# Altium project Blackbox_V2.PrjPcb
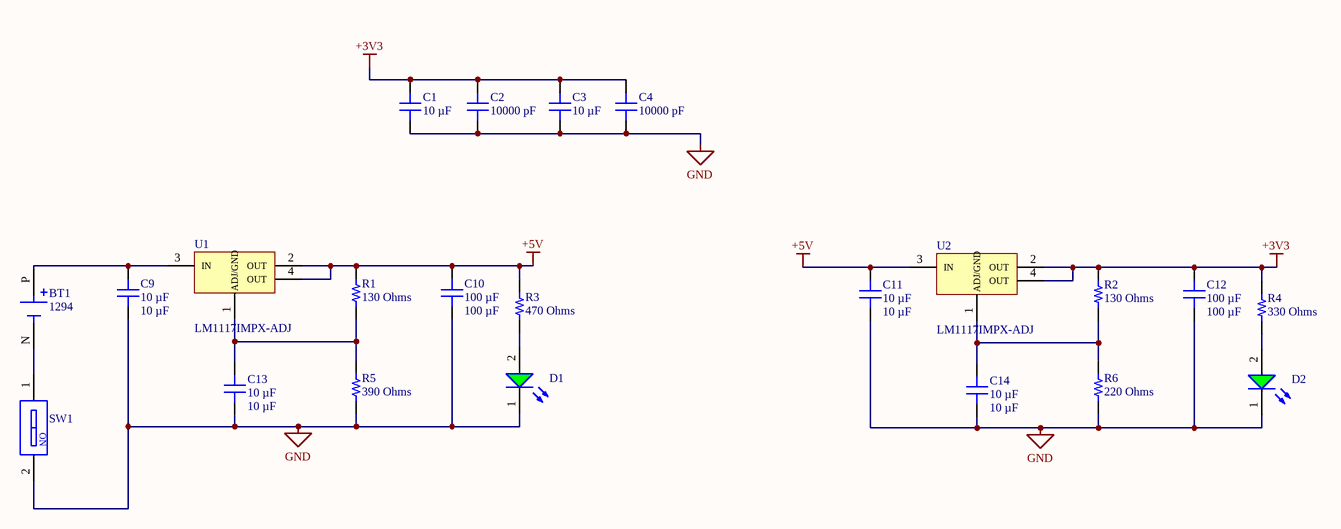
[diagram p0: Power.SchDoc]
4 sheets, 76 parts. Net scope: flat (ports and power ports of the same name join across sheets).
Board files: PCB1.PcbDoc, PCB2.PcbDoc
Sheets:
  Power.SchDoc
  Communication.SchDoc
  Microcontroller.SchDoc
  Filters.SchDoc

## Sheet Power.SchDoc
size A4; SheetNumber: 1; SheetTotal: 4; SPICEModelCacheJPOIHVMT: <root> / <DocumentId>JPOIHVMT</DocumentId> / <CacheFrame Number="0"> / <Model Name="0805_150080gs75000" Kind="CKT"> / <Text>****** / .subckt 0805_150080GS75000  1  2 / D1 1 2 SMCW / .MODEL SMCW D / + IS=906.98E-12 / + N=4.4982 / + RS=1.5743 / + IKF=518.93E-9 / + CJO=1.0000E-12 / + M=.3333 / + VJ=.75 / + BV=5 / + IBV=10.00E-6 / + TT=5.0000E-9 / .ends</Text> / </Model> / </CacheFrame> / </root>

### Parts
BT1  1294  [BAT_1294]
C1  10 µF  [CAP 0805_2012]
C2  10000 pF  [CAP 0805_2012]
C3  10 µF  [CAP 0805_2012]
C4  10000 pF  [CAP 0805_2012]
C9  10 µF  [CAP 0805_2012]
C10  100 µF  [CAP 0805_2012]
C11  10 µF  [CAP 0805_2012]
C12  100 µF  [CAP 0805_2012]
C13  10 µF  [CAP 0805_2012]
C14  10 µF  [CAP 0805_2012]
D1  Green, 3.2V, 140°  [WL-SMCW_0805_150080xx75000]  (value not drawn)
D2  Green, 3.2V, 140°  [WL-SMCW_0805_150080xx75000]  (value not drawn)
R1  130 Ohms  [RES 0805_2012]
R2  130 Ohms  [RES 0805_2012]
R3  470 Ohms  [RES 0805_2012]
R4  330 Ohms  [RES 0805_2012]
R5  390 Ohms  [RES 0805_2012]
R6  220 Ohms  [RES 0805_2012]
SW1  418121270801  [418121270801]  (value not drawn)
U1  LM1117IMPX-ADJ  [SOT-223-4 M]
U2  LM1117IMPX-ADJ  [SOT-223-4 M]

### Nets
+3V3: C1.1 C2.2 C3.1 C4.2 C12.2 R2.2 R4.2 U2.2(OUT) U2.4(OUT)
+5V: C10.2 C11.2 R1.2 R3.2 U1.2(OUT) U1.4(OUT) U2.3(IN)
GND: C1.2 C2.1 C3.2 C4.1 C9.1 C10.1 C11.1 C12.1 C13.1 C14.1 D1.1(K) D2.1(K) R5.1 R6.1 SW1.2
NetBT1_N: BT1.N(NEG) SW1.1
NetBT1_P: BT1.P(POS) C9.2 U1.3(IN)
NetC13_2: C13.2 R1.1 R5.2 U1.1(ADJ/GND)
NetC14_2: C14.2 R2.1 R6.2 U2.1(ADJ/GND)
NetD1_2: D1.2(A) R3.1
NetD2_2: D2.2(A) R4.1

### Notes on the sheet
- (in symbol 418121270801) ON

### Library data of the parts
BT1 = Bat-1294: 9V battery holder; Package: None; MP: 1294; Value: *; Availability: Unavailable; Price: None
C1 C3 = C0805C106K3PAC7800: CAP CER 10UF 25V X5R 0805; manufacturer: KEMET; Tolerance: ±10%; Part Number: C0805C106K3PAC7800; Value: 10 µF; Applications: Bypass, Decoupling; Capacitance: 10 µF; componentlink1description: Datasheet; componentlink1url: https://api.kemet.com/component-edge/download/datasheet/C0805C106K3PAC7800.pdf; componentlink2description: DigiKey Link; componentlink2url: https://www.digikey.com/en/products/detail/kemet/C0805C106K3PAC7800/5267604; Device Package: 0805 (2012 Metric); lastupdated: 9.02.2024 20:15:18; Lifecycle Status: Active; Minimum Order: 1; Mounting Type: Surface Mount, MLCC; Operating Temperature: -55°C ~ 85°C; Package / Case: 0805 (2012 Metric); packaging: TapeAndReel; partid: 18542; Part Status: Active; price: 0.03; series: SMD Comm X5R; Size / Dimension: 0.079" L x 0.049" W (2.00mm x 1.25mm); Supplier 1: DigiKey; Supplier Part Number 1: 399-11939-1-ND; Temperature Coefficient: X5R; Thickness (Max): 0.057" (1.45mm); Voltage - Rated: 25V
C2 C4 = C0805C103J3GECAUTO: CAP CER 0805 10NF 25V C0G 5%; manufacturer: KEMET; Temperature Coefficient: C0G, NP0; Part Number: C0805C103J3GECAUTO; Value: 10000 pF; Applications: Automotive, ESD Protection; Capacitance: 10000 pF; componentlink1description: Datasheet; componentlink1url: https://api.kemet.com/component-edge/download/datasheet/C0805C103J3GECAUTO.pdf; componentlink2description: DigiKey Link; componentlink2url: https://www.digikey.com/en/products/detail/kemet/C0805C103J3GECAUTO/8647361; Device Package: 0805 (2012 Metric); Features: Low ESL; lastupdated: 9.02.2024 20:15:09; Lifecycle Status: Active; Minimum Order: 1; Mounting Type: Surface Mount, MLCC; Operating Temperature: -55°C ~ 125°C; Package / Case: 0805 (2012 Metric); packaging: TapeAndReel; partid: 32681; Part Status: Active; price: 0.05; Ratings: AEC-Q200; series: ESD SMD Auto C0G; Size / Dimension: 0.079" L x 0.049" W (2.00mm x 1.25mm); Supplier 1: DigiKey; Supplier Part Number 1: 399-C0805C103J3GECAUTOCT-ND; Thickness (Max): 0.039" (1.00mm); Tolerance: ±5%; Voltage - Rated: 25V
C9 C11 C13 C14 = CL21Y106KPQVPNE: CAP CER 10UF 10V X7S 0805; Part Number: CL21Y106KPQVPNE; Value: 10 µF
C10 C12 = PMK212BBJ107MG-T: CAP CER 100UF 2.5V X5R 0805; Part Number: PMK212BBJ107MG-T; Value: 100 µF
D1 D2 = 150080GS75000: WL-SMCW Mono-color Chip LED Waterclear, size 0805, Green, 3.2V, 140°; Manufacturer: Wurth Elektronik; Case/Size Code: 0805; Chip Technology: InGaN; Dominant Wavelength: 525nm; Luminous Intensity: 450mcd; Peak Wavelength: 515nm; Manufacturer Part Number: 150080GS75000; Category: Signal LEDs; Match Code: WL-SMCW; ComponentLink1Description: Website Link; ComponentLink1URL: https://www.we-online.com/redexpert/article/150080GS75000?ad; ComponentLink2Description: Datasheet Link; ComponentLink2URL: https://www.we-online.com/redexpert/spec/150080GS75000?ad; Mount: Surface Mount; Operating Temperature Max: 85°C; Operating Temperature Min: -40°C; Packaging: Tape and Reel; Length: 2mm; Width: 1.25mm; Height: 0.7mm; Emitting Color: Green; Forward Voltage: 3.2V; Viewing Angle: 140°
R1 R2 = 3-2176091-5: RES SMD 130 OHM 0.1% 1/4W 0805; Manufacturer: TE Connectivity Passive Product; Power (Watts): 0.25W, 1/4W; Temperature Coefficient: ±25ppm/°C; Part Number: 3-2176091-5; Value: 130 Ohms; ComponentLink1Description: Datasheet; ComponentLink1URL: https://www.te.com/commerce/DocumentDelivery/DDEController?Action=srchrtrv&DocNm=1773272&DocType=DS&DocLang=English; ComponentLink2Description: DigiKey Link; ComponentLink2URL: https://www.digikey.com/en/products/detail/te-connectivity-passive-product/3-2176091-5/4033926; Composition: Thin Film; Device Package: 0805 (2012 Metric); Height - Seated (Max): 0.026" (0.65mm); LastUpdated: 8.02.2024 21:00:46; Lifecycle Status: Active; Minimum Order: 1; Number of Terminations: 2; Operating Temperature: -55°C ~ 155°C; Package / Case: 0805 (2012 Metric); Packaging: TapeAndReel; PartId: 49761; Part Status: Active; Price: 0.14; Resistance: 130 Ohms; Series: RP73P, Holsworthy; Size / Dimension: 0.079" L x 0.049" W (2.00mm x 1.25mm); Supplier 1: DigiKey; Supplier Part Number 1: A110458CT-ND; Supplier Device Package: 0805; Tolerance: ±0.1%
R3 = 3430A2F470RTDF: 3430 A2 1% 470R 100PPM 1K RL; Manufacturer: TE Connectivity Passive Product; Power (Watts): 1W; Temperature Coefficient: ±100ppm/°C; Part Number: 3430A2F470RTDF; Value: 470 Ohms; ComponentLink2Description: DigiKey Link; ComponentLink2URL: https://www.digikey.com/en/products/detail/te-connectivity-passive-product/3430A2F470RTDF/17763718; Composition: Thick Film; Device Package: 0805 (2012 Metric); Features: Automotive AEC-Q200; Height - Seated (Max): 0.026" (0.65mm); LastUpdated: 8.02.2024 21:00:03; Lifecycle Status: Active; Minimum Order: 1; Number of Terminations: 2; Operating Temperature: -55°C ~ 155°C; Package / Case: 0805 (2012 Metric); Packaging: TapeAndReel; PartId: 77780; Part Status: Active; Price: 0.02; Ratings: AEC-Q200; Resistance: 470 Ohms; Series: 3430; Size / Dimension: 0.049" L x 0.079" W (1.25mm x 2.00mm); Supplier 1: DigiKey; Supplier Part Number 1: 1712-3430A2F470RTDFCT-ND; Supplier Device Package: 0508; Tolerance: ±1%
R4 = 3430A2F330RTDF: 3430 A2 1% 330R 100PPM 1K RL; Manufacturer: TE Connectivity Passive Product; Power (Watts): 1W; Temperature Coefficient: ±100ppm/°C; Part Number: 3430A2F330RTDF; Value: 330 Ohms; ComponentLink2Description: DigiKey Link; ComponentLink2URL: https://www.digikey.com/en/products/detail/te-connectivity-passive-product/3430A2F330RTDF/17762827; Composition: Thick Film; Device Package: 0805 (2012 Metric); Features: Automotive AEC-Q200; Height - Seated (Max): 0.026" (0.65mm); LastUpdated: 8.02.2024 21:00:04; Lifecycle Status: Active; Minimum Order: 1; Number of Terminations: 2; Operating Temperature: -55°C ~ 155°C; Package / Case: 0805 (2012 Metric); Packaging: TapeAndReel; PartId: 77524; Part Status: Active; Price: 0.02; Ratings: AEC-Q200; Resistance: 330 Ohms; Series: 3430; Size / Dimension: 0.049" L x 0.079" W (1.25mm x 2.00mm); Supplier 1: DigiKey; Supplier Part Number 1: 1712-3430A2F330RTDFCT-ND; Supplier Device Package: 0508; Tolerance: ±1%
R5 = 3430A2F390RTDF: 3430 A2 1% 390R 100PPM 1K RL; Manufacturer: TE Connectivity Passive Product; Power (Watts): 1W; Temperature Coefficient: ±100ppm/°C; Part Number: 3430A2F390RTDF; Value: 390 Ohms; ComponentLink2Description: DigiKey Link; ComponentLink2URL: https://www.digikey.com/en/products/detail/te-connectivity-passive-product/3430A2F390RTDF/17763108; Composition: Thick Film; Device Package: 0805 (2012 Metric); Features: Automotive AEC-Q200; Height - Seated (Max): 0.026" (0.65mm); LastUpdated: 8.02.2024 21:00:03; Lifecycle Status: Active; Minimum Order: 1; Number of Terminations: 2; Operating Temperature: -55°C ~ 155°C; Package / Case: 0805 (2012 Metric); Packaging: TapeAndReel; PartId: 77771; Part Status: Active; Price: 0.02; Ratings: AEC-Q200; Resistance: 390 Ohms; Series: 3430; Size / Dimension: 0.049" L x 0.079" W (1.25mm x 2.00mm); Supplier 1: DigiKey; Supplier Part Number 1: 1712-3430A2F390RTDFCT-ND; Supplier Device Package: 0508; Tolerance: ±1%
R6 = CPF0805B220RE1: RES SMD 220 OHM 0.1% 1/10W 0805; Manufacturer: TE Connectivity Passive Product; Power (Watts): 0.1W, 1/10W; Temperature Coefficient: ±25ppm/°C; Part Number: CPF0805B220RE1; Value: 220 Ohms; ComponentLink1Description: Datasheet; ComponentLink1URL: https://www.te.com/commerce/DocumentDelivery/DDEController?Action=srchrtrv&DocNm=1773200&DocType=DS&DocLang=English; ComponentLink2Description: DigiKey Link; ComponentLink2URL: https://www.digikey.com/en/products/detail/te-connectivity-passive-product/CPF0805B220RE1/2382016; Composition: Thin Film; Device Package: 0805 (2012 Metric); Height - Seated (Max): 0.026" (0.65mm); LastUpdated: 8.02.2024 21:02:21; Lifecycle Status: Active; Minimum Order: 1; Number of Terminations: 2; Operating Temperature: -55°C ~ 155°C; Package / Case: 0805 (2012 Metric); Packaging: TapeAndReel; PartId: 31853; Part Status: Active; Price: 0.12; Resistance: 220 Ohms; Series: CPF, Neohm; Size / Dimension: 0.079" L x 0.049" W (2.00mm x 1.25mm); Supplier 1: DigiKey; Supplier Part Number 1: A103177CT-ND; Supplier Device Package: 0805; Tolerance: ±0.1%
SW1 = 418121270801: WS-DISV Small Compact SMT Dip Switch, Raised Actuator, pitch 2.54mm, 1p; Manufacturer: Wurth Elektronik; Actuator Type: Raise Type; Operation Force: 600g; Number of Poles: 1; Rated Current Non-Switching: 100mA; Rated Current Switching: 25mA; Rated Voltage Non-Switching: 50VDC; Rated Voltage Switching: 24VDC; Manufacturer Part Number: 418121270801; Category: Dip Switches; Match Code: WS-DISV; ComponentLink1Description: Website Link; ComponentLink1URL: https://www.we-online.com/redexpert/article/418121270801?ad; ComponentLink2Description: Datasheet Link; ComponentLink2URL: https://www.we-online.com/redexpert/spec/418121270801?ad; Mount: Surface Mount; Operating Temperature Max: 85°C; Operating Temperature Min: -40°C; Packaging: Tape and Reel; Contact Material: Copper Alloy; Contact Plating: Gold; Pitch: 2.54mm
U1 U2 = LM1117IMPX-ADJ: LDO Regulator Pos 3.3V 0.8A 4-Pin(3+Tab) SOT-223 T/R; Manufacturer: Texas Instruments; Manufacturer Part Number: LM1117IMPX-3.3; Output Current: 800mA; Dropout Voltage: 1.2V; Quiescent Current: 15mA; Number of Outputs: 1; Max Input Voltage: 15V; Polarity: Positive; Accuracy: 1%; Output Type: Fixed; RoHS: No; Category: Voltage Regulators - Linear; Mount: Surface Mount; Case/Package: SOT-223; Number of Pins: 4; Min Operating Temperature: -40°C; Max Operating Temperature: 125°C; Output Voltage: 3.3V; Packaging: Tape and Reel; Max Output Current: 800mA; Output Voltage Accuracy: 1%; Package Quantity: 2000; Number of Regulators: 1; Min Current Limit: 800mA; Lead Free: Contains Lead; ComponentLink1URL: https://datasheet.ciiva.com/6588/lm1117-n-6588632.pdf?src-supplier=Digi-Key; ComponentLink1Description: https://datasheet.ciiva.com/6588/lm1117-n-6588632.pdf?src-supplier=Digi-Key; ComponentLink2URL: https://datasheet.ciiva.com/6588/lm1117-n-6588636.pdf?src-supplier=Digi-Key; ComponentLink2Description: https://datasheet.ciiva.com/6588/lm1117-n-6588636.pdf?src-supplier=Digi-Key; ComponentLink3URL: https://datasheet.ciiva.com/6588/lm1117-n-6588639.pdf?src-supplier=Digi-Key; ComponentLink3Description: https://datasheet.ciiva.com/6588/lm1117-n-6588639.pdf?src-supplier=Digi-Key; Supplier 1: Mouser; Supplier Part Number 1: 926-M1117IMPXADJNOPB

## Sheet Communication.SchDoc
size A4; SheetNumber: 2; SheetTotal: 4
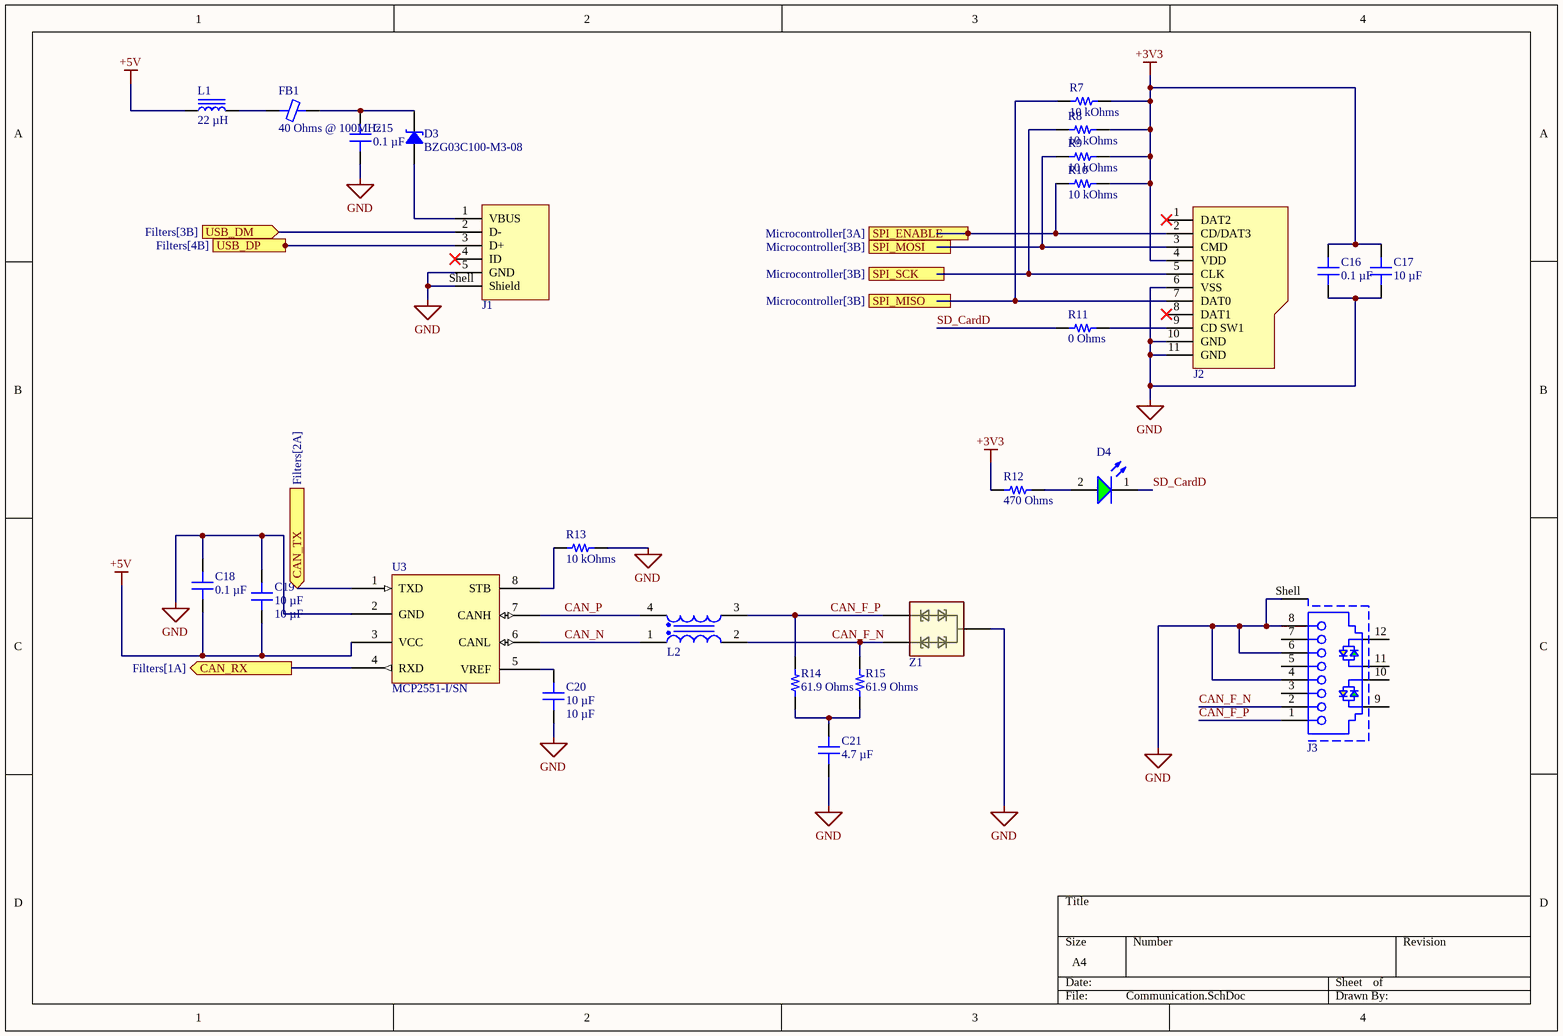
[diagram p1: Communication.SchDoc]

### Parts
C15  0.1 µF  [CAP 0805_2012]
C16  0.1 µF  [CAP 0805_2012]
C17  10 µF  [CAP 0805_2012]
C18  0.1 µF  [CAP 0805_2012]
C19  10 µF  [CAP 0805_2012]
C20  10 µF  [CAP 0805_2012]
C21  4.7 µF  [CAP 0805_2012]
D3  BZG03C100-M3-08  [DO214AC SMA]
D4  Green, 3.2V, 140°  [WL-SMCW_0805_150080xx75000]  (value not drawn)
FB1  40 Ohms @ 100MHz  [FER 0805_2012]
J1  629105150521  [629105150521]  (value not drawn)
J2  693071030811  [693071030811]  (value not drawn)
J3  615008142121  [615008142121]  (value not drawn)
L1  22 µH  [IND 0806_2016]
L2  5000Ohm  [WE-CNSW_1812]  (value not drawn)
R7  10 kOhms  [RES 0805_2012]
R8  10 kOhms  [RES 0805_2012]
R9  10 kOhms  [RES 0805_2012]
R10  10 kOhms  [RES 0805_2012]
R11  0 Ohms  [RES 0805_2012]
R12  470 Ohms  [RES 0805_2012]
R13  10 kOhms  [RES 0805_2012]
R14  61.9 Ohms  [RES 0805_2012]
R15  61.9 Ohms  [RES 0805_2012]
U3  Supplier Part Number 1: MCP2551-I/SN  [MCP2551T-I/SN]  (hidden comment: MCP2551)
Z1  PESD2CAN,215  [SOT95P230X110-3N]  (value not drawn)

### Ports
CAN_RX (out, see Filters[1A]), CAN_TX (in, see Filters[2A]), SPI_ENABLE (in, see Microcontroller[3A]), SPI_MISO (out, see Microcontroller[3B]), SPI_MOSI (in, see Microcontroller[3B]), SPI_SCK (in, see Microcontroller[3B]), USB_DM (in, see Filters[3B]), USB_DP (out, see Filters[4B])

### Nets
+3V3: C16.2 C17.2 J2.4(VDD) R7.2 R8.2 R9.2 R10.2 R12.1
+5V: C18.2 C19.1 L1.1 U3.3(VCC)
GND: C15.1 C16.1 C17.1 C18.1 C19.2 C20.1 C21.1 J1.5(GND) J1.Shell(Shield) J2.6(VSS) J2.10(GND) J2.11(GND) J3.4 J3.6 J3.8 J3.Shell R13.2 U3.2(GND) Z1.3
CAN_F_N: J3.2 L2.2 R15.2 Z1.2
CAN_F_P: J3.1 L2.3 R14.2 Z1.1
CAN_N: L2.1 U3.6(CANL)
CAN_P: L2.4 U3.7(CANH)
CAN_RX: U3.4(RXD) ; port CAN_RX
CAN_TX: U3.1(TXD) ; port CAN_TX
SD_CardD: D4.1(K) R11.1
USB_DM: J1.2(D-) ; port USB_DM
USB_DP: J1.3(D+) ; port USB_DP
NetC15_2: C15.2 D3.2 FB1.2
NetC20_2: C20.2 U3.5(VREF)
NetC21_2: C21.2 R14.1 R15.1
NetD3_1: D3.1 J1.1(VBUS)
NetD4_2: D4.2(A) R12.2
NetFB1_1: FB1.1 L1.2
NetIC1_14: J2.2(CD/DAT3) R10.1 ; port SPI_ENABLE
NetIC1_15: J2.5(CLK) R8.1 ; port SPI_SCK
NetIC1_16: J2.7(DAT0) R7.1 ; port SPI_MISO
NetIC1_17: J2.3(CMD) R9.1 ; port SPI_MOSI
NetJ2_9: J2.9(CD_SW1) R11.2
NetR13_1: R13.1 U3.8(STB)

Not connected (* = marked no-connect by the designer): J1 4(ID)*; J2 1(DAT2)* 8(DAT1)*; J3 3 5 7 9 10 11 12

### Library data of the parts
C15 C16 C18 = CC0805MRX7R9BB104: CAP CER 0.1UF 50V X7R 0805; manufacturer: Yageo; Tolerance: ±20%; Part Number: CC0805MRX7R9BB104; Value: 0.1 µF; Applications: General Purpose; Capacitance: 0.1 µF; componentlink1description: Datasheet; componentlink1url: https://www.yageo.com/upload/media/product/productsearch/datasheet/mlcc/UPY-GPHC_X7R_6.3V-to-50V_18.pdf; componentlink2description: DigiKey Link; componentlink2url: https://www.digikey.com/en/products/detail/yageo/CC0805MRX7R9BB104/5884281; Device Package: 0805 (2012 Metric); lastupdated: 9.02.2024 20:16:09; Lifecycle Status: Active; Minimum Order: 1; Mounting Type: Surface Mount, MLCC; Operating Temperature: -55°C ~ 125°C; Package / Case: 0805 (2012 Metric); packaging: TapeAndReel; partid: 2475; Part Status: Active; price: 0.01; series: CC; Size / Dimension: 0.079" L x 0.049" W (2.00mm x 1.25mm); Supplier 1: DigiKey; Supplier Part Number 1: 311-4351-1-ND; Temperature Coefficient: X7R; Thickness (Max): 0.037" (0.95mm); Voltage - Rated: 50V
C17 = CL21Y106KPQVPNE: CAP CER 10UF 10V X7S 0805; manufacturer: Samsung Electro-Mechanics; Tolerance: ±10%; Part Number: CL21Y106KPQVPNE; Value: 10 µF; Applications: Automotive; Capacitance: 10 µF; componentlink1description: Datasheet; componentlink1url: http://www.samsungsem.com/kr/support/product-search/mlcc/CL21Y106KPQVPNE.jsp; componentlink2description: DigiKey Link; componentlink2url: https://www.digikey.com/en/products/detail/samsung-electro-mechanics/CL21Y106KPQVPNE/5961169; Device Package: 0805 (2012 Metric); lastupdated: 9.02.2024 20:16:08; Lifecycle Status: Active; Minimum Order: 1; Mounting Type: Surface Mount, MLCC; Operating Temperature: -55°C ~ 125°C; Package / Case: 0805 (2012 Metric); packaging: TapeAndReel; partid: 2979; Part Status: Active; price: 0.06; Ratings: AEC-Q200; series: CL; Size / Dimension: 0.079" L x 0.049" W (2.00mm x 1.25mm); Supplier 1: DigiKey; Supplier Part Number 1: 1276-6685-1-ND; Temperature Coefficient: X7S; Thickness (Max): 0.055" (1.40mm); Voltage - Rated: 10V
C19 C20 = CL21Y106KPQVPNE: CAP CER 10UF 10V X7S 0805; Part Number: CL21Y106KPQVPNE; Value: 10 µF
C21 = CL21B475KAFNNNE: CAP CER 4.7UF 25V X7R 0805; manufacturer: Samsung Electro-Mechanics; Tolerance: ±10%; Part Number: CL21B475KAFNNNE; Value: 4.7 µF; Applications: General Purpose; Capacitance: 4.7 µF; componentlink1description: Datasheet; componentlink1url: http://www.samsungsem.com/kr/support/product-search/mlcc/CL21B475KAFNNNE.jsp; componentlink2description: DigiKey Link; componentlink2url: https://www.digikey.com/en/products/detail/samsung-electro-mechanics/CL21B475KAFNNNE/3888627; Device Package: 0805 (2012 Metric); lastupdated: 9.02.2024 20:16:07; Lifecycle Status: Active; Minimum Order: 1; Mounting Type: Surface Mount, MLCC; Operating Temperature: -55°C ~ 125°C; Package / Case: 0805 (2012 Metric); packaging: TapeAndReel; partid: 3072; Part Status: Active; price: 0.08; series: CL; Size / Dimension: 0.079" L x 0.049" W (2.00mm x 1.25mm); Supplier 1: DigiKey; Supplier Part Number 1: 1276-2969-1-ND; Temperature Coefficient: X7R; Thickness (Max): 0.053" (1.35mm); Voltage - Rated: 25V
D3 = BZG03C100-M3-08: DIODE ZENER 100V 1.25W DO214AC; Manufacturer: Vishay Semiconductor Diodes Division; Current - Reverse Leakage @ Vr: 1µA @ 75V; Impedance (Max) (Zzt): 200 Ohms; Tolerance: ±6%; Voltage - Forward (Vf) (Max) @ If: 1.2V @ 500mA; Part Number: BZG03C100-M3-08; ComponentLink1Description: Datasheet; ComponentLink1URL: http://www.vishay.com/docs/86138/bzg03c-m-series.pdf; ComponentLink2Description: DigiKey Link; ComponentLink2URL: http://digikey.com/product-detail/en/vishay-semiconductor-diodes-division/BZG03C100-M3-08/BZG03C100-M3-08GICT-ND/8554991; LastUpdated: 3.06.2024 19:55:28; Lifecycle Status: Active; Minimum Order: 1; Mounting Type: Surface Mount; Operating Temperature: 150°C (TJ); Package / Case: DO-214AC, SMA; Packaging: TapeAndReel; PartId: 1296; Part Status: Active; Power - Max: 1.25W; Price: 0.18; Series: BZG03C-M; Supplier 1: DigiKey; Supplier Part Number 1: BZG03C100-M3-08GICT-ND; Supplier Device Package: DO-214AC (SMA); Voltage - Zener (Nom) (Vz): 100V
D4 = 150080GS75000: as D1 on sheet Power; Manufacturer Part Number: 150080GS75000; Category: Signal LEDs; Match Code: WL-SMCW; ComponentLink1Description: Website Link; ComponentLink1URL: https://www.we-online.com/redexpert/article/150080GS75000?ad; ComponentLink2Description: Datasheet Link; ComponentLink2URL: https://www.we-online.com/redexpert/spec/150080GS75000?ad; Mount: Surface Mount; Operating Temperature Max: 85°C; Operating Temperature Min: -40°C; Packaging: Tape and Reel; Length: 2mm; Width: 1.25mm; Height: 0.7mm; Emitting Color: Green; Forward Voltage: 3.2V; Viewing Angle: 140°
FB1 = ILBB0805ER400V: FERRITE BEAD 40 OHM 0805 1LN; Manufacturer: Vishay Dale; Current Rating (Max): 300mA; DC Resistance (DCR) (Max): 150mOhm; Number of Lines: 1; Part Number: ILBB0805ER400V; ComponentLink1Description: Datasheet; ComponentLink1URL: https://www.vishay.com/docs/34025/ilbb0805.pdf; ComponentLink2Description: DigiKey Link; ComponentLink2URL: http://digikey.com/product-detail/en/vishay-dale/ILBB0805ER400V/ILBB0805ER400V-ND/2574916; Height (Max): 0.043" (1.10mm); Impedance @ Frequency: 40 Ohms @ 100MHz; LastUpdated: 30.08.2020 20:58:50; Lifecycle Status: Active; Minimum Order: 8000; Mounting Type: Surface Mount; Package / Case: 0805 (2012 Metric); Packaging: TapeAndReel; PartId: 2358; Price: 0.02; Series: ILBB-0805; Size / Dimension: 0.079" L x 0.049" W (2.00mm x 1.25mm); Supplier 1: DigiKey; Supplier Part Number 1: ILBB0805ER400V-ND; Value: 40 Ohms @ 100MHz
J1 = 629105150521: WR-COM Micro USB 2.0 SMT Type B Horizontal 5 Contacts High Current; Manufacturer: Wurth Elektronik; Match Code: WR-USB; Gender: Receptacle; Interface Type: Type B; Number of Ports: 1; Rated Current: 3A; Working Voltage: 30V (AC); Manufacturer Part Number: 629105150521; Category: Input/Output Connectors; ComponentLink1Description: Website Link; ComponentLink1URL: https://www.we-online.com/redexpert/article/629105150521?ad; ComponentLink2Description: Datasheet Link; ComponentLink2URL: https://www.we-online.com/redexpert/spec/629105150521?ad; Mount: Surface Mount; Operating Temperature Max: 85°C; Operating Temperature Min: -40°C; Packaging: Tape and Reel; Application: Micro USB 2.0; Number of Pins: 5; Orientation: Horizontal
J2 = 693071030811: WR-CRD Micro SD Card Connector Push & Push; Manufacturer: Wurth Elektronik; Contact Resistance: 100mOhm; Gender: Socket; Rated Current: 0.5A; Working Voltage: 30VAC; Withstanding Voltage: 500VAC; Manufacturer Part Number: 693071030811; Category: Input/Output Connectors; Match Code: WR-CRD; ComponentLink1Description: Website Link; ComponentLink1URL: https://www.we-online.com/redexpert/article/693071030811?ad; ComponentLink2Description: Datasheet Link; ComponentLink2URL: https://www.we-online.com/redexpert/spec/693071030811?ad; Mount: Surface Mount; Operating Temperature Max: 85°C; Operating Temperature Min: -25°C; Packaging: Tape and Reel; Number of Pins: 8; Type: Push & Push
J3 = 615008142121: WR-MJ Modular Jack THT Horizontal Shielded 8P8C Tab Up; Manufacturer: Wurth Elektronik; Contact Resistance: 20mOhm; Insulation Resistance: 500MOhm; LED: Bipolar Y/G; Number of Ports: 1; Rated Current: 1.5A; Shielding: Yes; Working Voltage: 120VAC; Withstanding Voltage: 1000VAC; Manufacturer Part Number: 615008142121; Category: Input/Output Connectors; Match Code: WR-MJ; ComponentLink1Description: Website Link; ComponentLink1URL: https://www.we-online.com/redexpert/article/615008142121?ad; ComponentLink2Description: Datasheet Link; ComponentLink2URL: https://www.we-online.com/redexpert/spec/615008142121?ad; Mount: Through Hole; Operating Temperature Max: 85°C; Operating Temperature Min: -40°C; Packaging: Tray; Number of Pins: 8P8C; Orientation: Horizontal
L1 = LSQPB201616T220M: FIXED IND 22UH 310MA 1 OHM SMD; Manufacturer: Taiyo Yuden; DC Resistance (DCR): 1.3Ohm Max; Frequency - Self Resonant: 24MHz; Inductance Frequency - Test: 100 kHz; Material - Core: Ferrite; Shielding: Unshielded; Tolerance: ±20%; Type: Wirewound; Part Number: LSQPB201616T220M; ComponentLink1Description: Datasheet; ComponentLink1URL: https://mm.digikey.com/Volume0/opasdata/d220001/medias/docus/6025/LSQPB201616T220M_SS.pdf; ComponentLink2Description: DigiKey Link; ComponentLink2URL: https://www.digikey.com/en/products/detail/taiyo-yuden/LSQPB201616T220M/16660797; Current Rating (Amps): 310 mA; Device Package: 0806 (2016 Metric); Height - Seated (Max): 0.071" (1.80mm); Inductance: 22 µH; LastUpdated: 3.06.2024 20:13:57; Lifecycle Status: Active; Minimum Order: 1; Mounting Type: Surface Mount; Operating Temperature: -40°C ~ 105°C; Package / Case: 0806 (2016 Metric); Packaging: TapeAndReel; PartId: 7265; Price: 0.09; Series: LSQP; Size / Dimension: 0.079" L x 0.063" W (2.00mm x 1.60mm); Supplier 1: DigiKey; Supplier Part Number 1: 587-LSQPB201616T220MCT-ND; Supplier Device Package: 0806; Value: 22 µH
L2 = 744235101: WE-CNSW SMT Common Mode Line Filter, size 1812, 5000Ohm, 100uH, 60V; Manufacturer: Wurth Elektronik; Case/Size Code: 1812; DC Resistance Max: 2Ohm; Insulation Test Voltage (AC): 125V; Rated Current: 0.15A; Winding Style: bifiliar; Manufacturer Part Number: 744235101; Category: Common Mode Chokes; Match Code: WE-CNSW; ComponentLink1Description: Website Link; ComponentLink1URL: https://www.we-online.com/redexpert/article/744235101?ad; ComponentLink2Description: Datasheet Link; ComponentLink2URL: https://www.we-online.com/redexpert/spec/744235101?ad; Mount: Surface Mount; Operating Temperature Max: 125°C; Operating Temperature Min: -40°C; Packaging: Tape and Reel; Length: 4.5mm; Width: 3.2mm; Height: 2.8mm; Impedance @10MHz: 5000Ohm; Inductance: 100uH; Rated Voltage: 60V
R7-R10 R13 = 2176093-5: RES SMD 10K OHM 0.1% 1/4W 0805; Manufacturer: TE Connectivity Passive Product; Power (Watts): 0.25W, 1/4W; Temperature Coefficient: ±25ppm/°C; Part Number: 2176093-5; Value: 10 kOhms; ComponentLink1Description: Datasheet; ComponentLink1URL: https://www.te.com/commerce/DocumentDelivery/DDEController?Action=srchrtrv&DocNm=1773272&DocType=DS&DocLang=English; ComponentLink2Description: DigiKey Link; ComponentLink2URL: https://www.digikey.com/en/products/detail/te-connectivity-passive-product/2176093-5/4034107; Composition: Thin Film; Device Package: 0805 (2012 Metric); Height - Seated (Max): 0.026" (0.65mm); LastUpdated: 8.02.2024 21:02:35; Lifecycle Status: Active; Minimum Order: 1; Number of Terminations: 2; Operating Temperature: -55°C ~ 155°C; Package / Case: 0805 (2012 Metric); Packaging: TapeAndReel; PartId: 28478; Part Status: Active; Price: 0.14; Resistance: 10 kOhms; Series: RP73P, Holsworthy; Size / Dimension: 0.079" L x 0.049" W (2.00mm x 1.25mm); Supplier 1: DigiKey; Supplier Part Number 1: A110639CT-ND; Supplier Device Package: 0805; Tolerance: ±0.1%
R11 = 5107: RES 0 OHM JUMPER 0805; Part Number: 5107; Manufacturer: Keystone Electronics; Power (Watts): 0.5W, 1/2W; Value: 0 Ohms; ComponentLink1Description: Datasheet; ComponentLink1URL: http://www.keyelco.com/product-pdf.cfm?p=14350; ComponentLink2Description: DigiKey Link; ComponentLink2URL: https://www.digikey.com/en/products/detail/keystone-electronics/5107/7942981; Composition: Metal Element; Device Package: 0805 (2012 Metric); Height - Seated (Max): 0.033" (0.84mm); LastUpdated: 8.02.2024 21:01:23; Lifecycle Status: Active; Minimum Order: 1; Number of Terminations: 2; Package / Case: 0805 (2012 Metric); Packaging: TapeAndReel; PartId: 45276; Part Status: Active; Price: 0.16; Resistance: 0 Ohms; Series: -; Size / Dimension: 0.079" L x 0.049" W (2.00mm x 1.25mm); Supplier 1: DigiKey; Supplier Part Number 1: 36-5107CT-ND; Supplier Device Package: 0805; Tolerance: Jumper
R12 = 3430A2F470RTDF: as R3 on sheet Power; Part Number: 3430A2F470RTDF; Value: 470 Ohms; ComponentLink2Description: DigiKey Link; ComponentLink2URL: https://www.digikey.com/en/products/detail/te-connectivity-passive-product/3430A2F470RTDF/17763718; Composition: Thick Film; Device Package: 0805 (2012 Metric); Features: Automotive AEC-Q200; Height - Seated (Max): 0.026" (0.65mm); LastUpdated: 8.02.2024 21:00:03; Lifecycle Status: Active; Minimum Order: 1; Number of Terminations: 2; Operating Temperature: -55°C ~ 155°C; Package / Case: 0805 (2012 Metric); Packaging: TapeAndReel; PartId: 77780; Part Status: Active; Price: 0.02; Ratings: AEC-Q200; Resistance: 470 Ohms; Series: 3430; Size / Dimension: 0.049" L x 0.079" W (1.25mm x 2.00mm); Supplier 1: DigiKey; Supplier Part Number 1: 1712-3430A2F470RTDFCT-ND; Supplier Device Package: 0508; Tolerance: ±1%
R14 R15 = 2176091-4: RES SMD 61.9 OHM 0.1% 1/4W 0805; Manufacturer: TE Connectivity Passive Product; Power (Watts): 0.25W, 1/4W; Temperature Coefficient: ±25ppm/°C; Part Number: 2176091-4; Value: 61.9 Ohms; ComponentLink1Description: Datasheet; ComponentLink1URL: https://www.te.com/commerce/DocumentDelivery/DDEController?Action=srchrtrv&DocNm=1773272&DocType=DS&DocLang=English; ComponentLink2Description: DigiKey Link; ComponentLink2URL: https://www.digikey.com/en/products/detail/te-connectivity-passive-product/2176091-4/4033895; Composition: Thin Film; Device Package: 0805 (2012 Metric); Height - Seated (Max): 0.026" (0.65mm); LastUpdated: 8.02.2024 21:01:14; Lifecycle Status: Active; Minimum Order: 1; Number of Terminations: 2; Operating Temperature: -55°C ~ 155°C; Package / Case: 0805 (2012 Metric); Packaging: TapeAndReel; PartId: 46762; Part Status: Active; Price: 0.14; Resistance: 61.9 Ohms; Series: RP73P, Holsworthy; Size / Dimension: 0.079" L x 0.049" W (2.00mm x 1.25mm); Supplier 1: DigiKey; Supplier Part Number 1: A110427CT-ND; Supplier Device Package: 0805; Tolerance: ±0.1%
U3 = MCP2551: MCP2551 CAN Transreciever 8Mbit/sn; Virtual Junction Temperature (Tvj): -40°C ~ 150°C; VCANH-VCANL: -40V ~ 40V; Transreciever Hysteresis: 50mV; Differential Reciever Hysteresis: 100mV; Datasheet: https://www.nxp.com/docs/en/data-sheet/TJA1462.pdf; Operating Temperature: -40°C ~ 125°C; Supplier 1: Arrow Electronics
Z1 = PESD2CAN,215: Zener Diode; Manufacturer_Name: Nexperia; Datasheet Link: http://de.rs-online.com/webdocs/0b4d/0900766b80b4dbb6.pdf; Height: 1.1mm; Manufacturer_Part_Number: PESD2CAN,215; Mouser Part Number: 771-PESD2CAN-T/R; Mouser Price/Stock: https://www.mouser.com/Search/Refine.aspx?Keyword=771-PESD2CAN-T%2FR; RS Part Number: 0508462; RS Price/Stock: http://uk.rs-online.com/web/p/products/0508462

## Sheet Microcontroller.SchDoc
size A4; SheetNumber: 3; SheetTotal: 4
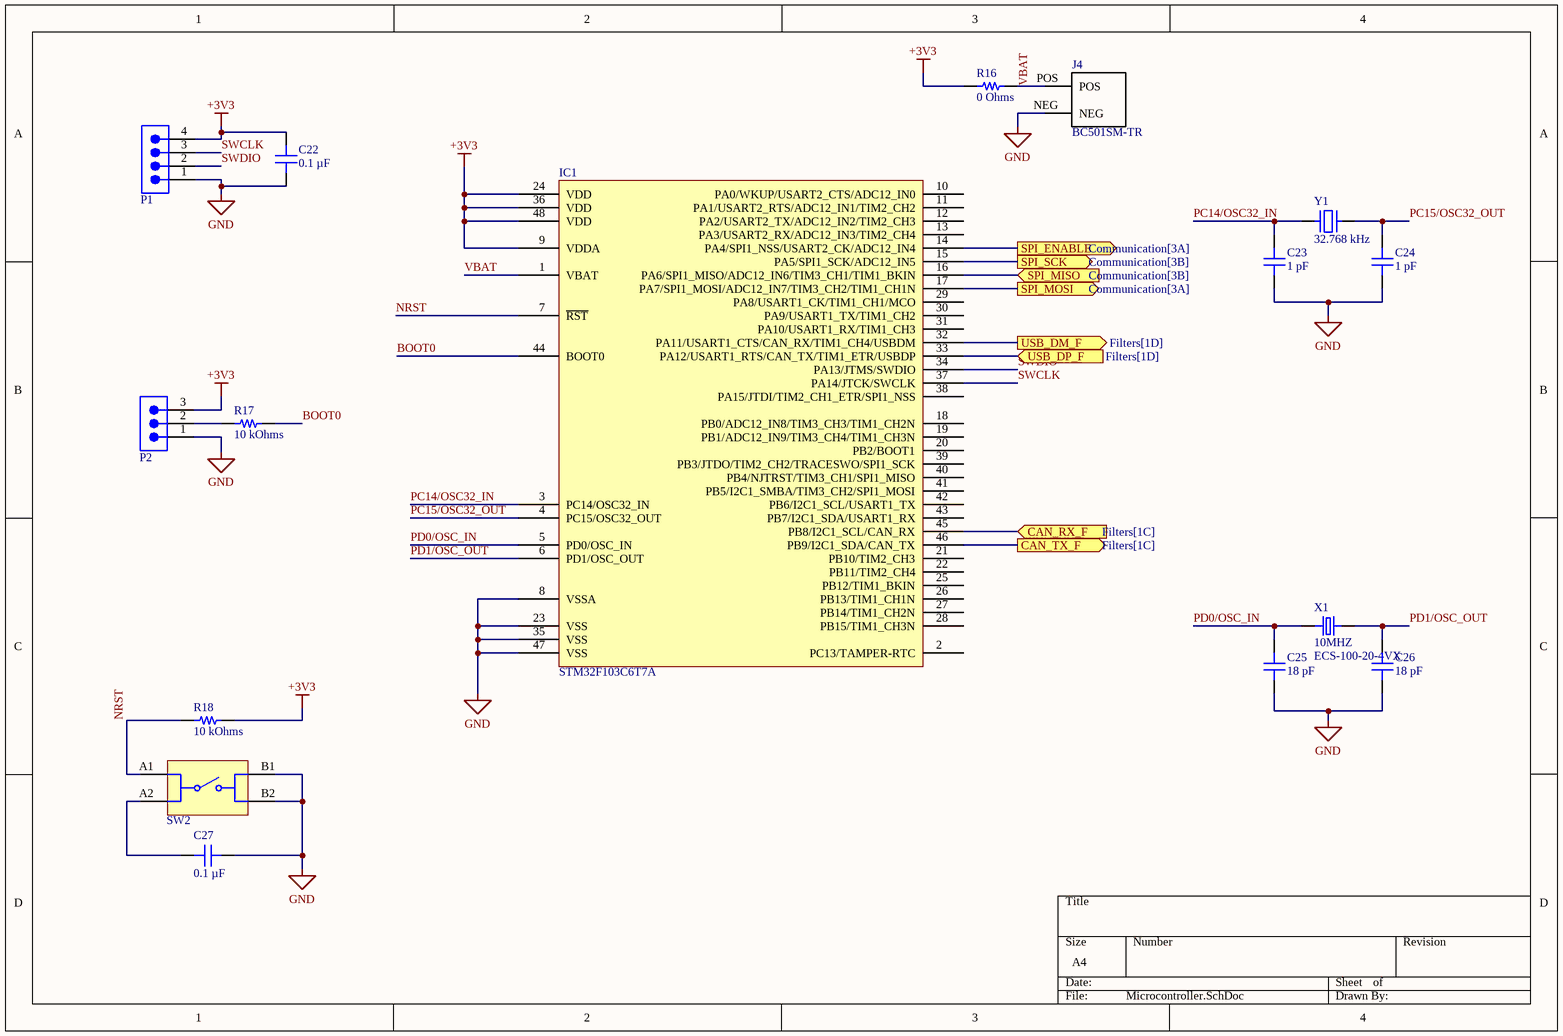
[diagram p2: Microcontroller.SchDoc]

### Parts
C22  0.1 µF  [CAP 0805_2012]
C23  1 pF  [CAP 0805_2012]
C24  1 pF  [CAP 0805_2012]
C25  18 pF  [CAP 0805_2012]
C26  18 pF  [CAP 0805_2012]
C27  0.1 µF  [CAP 0805_2012]
IC1  STM32F103C6T7A  [ST LQFP-48 7X7MM]
J4  BC501SM-TR  [*MPD_BC501SM-TR_BC501SM-TR(Primary) - duplicate]
P1  61900411121  [61900411121]  (value not drawn)
P2  61900311121  [61900311121]  (value not drawn)
R16  0 Ohms  [RES 0805_2012]
R17  10 kOhms  [RES 0805_2012]
R18  10 kOhms  [RES 0805_2012]
SW2  430152043826  [WS-TASV_L6W6H4.3_4301x20438x6]  (value not drawn)
X1  Frequency: 10MHZ  [XTAL_ECS-100-20-4VX]  (hidden comment: ECS-100-20-4VX)
Y1  32.768 kHz  [ABRACON ABS07]

### Ports
CAN_RX_F (in, see Filters[1C]), CAN_TX_F (out, see Filters[1C]), SPI_ENABLE (out, see Communication[3A]), SPI_MISO (in, see Communication[3B]), SPI_MOSI (out, see Communication[3A]), SPI_SCK (out, see Communication[3B]), USB_DM_F (out, see Filters[1D]), USB_DP_F (in, see Filters[1D])

### Nets
+3V3: C22.1 IC1.9(VDDA) IC1.24(VDD) IC1.36(VDD) IC1.48(VDD) P1.4 P2.3 R16.1 R18.2
GND: C22.2 C23.1 C24.1 C25.1 C26.1 C27.1 IC1.8(VSSA) IC1.23(VSS) IC1.35(VSS) IC1.47(VSS) J4.NEG P1.1 P2.1 SW2.B1 SW2.B2
BOOT0: IC1.44(BOOT0) R17.2
CAN_RX_F: IC1.45(PB8/I2C1_SCL/CAN_RX) ; port CAN_RX_F
CAN_TX_F: IC1.46(PB9/I2C1_SDA/CAN_TX) ; port CAN_TX_F
NRST: IC1.7(~{RST}) R18.1 SW2.A1
PC14/OSC32_IN: C23.2 IC1.3(PC14/OSC32_IN) Y1.1
PC15/OSC32_OUT: C24.2 IC1.4(PC15/OSC32_OUT) Y1.2
PD0/OSC_IN: C25.2 IC1.5(PD0/OSC_IN) X1.1
PD1/OSC_OUT: C26.2 IC1.6(PD1/OSC_OUT) X1.2
SWCLK: IC1.37(PA14/JTCK/SWCLK) P1.3
SWDIO: IC1.34(PA13/JTMS/SWDIO) P1.2
USB_DM_F: IC1.32(PA11/USART1_CTS/CAN_RX/TIM1_CH4/USBDM) ; port USB_DM_F
USB_DP_F: IC1.33(PA12/USART1_RTS/CAN_TX/TIM1_ETR/USBDP) ; port USB_DP_F
VBAT: IC1.1(VBAT) J4.POS R16.2
NetC27_2: C27.2 SW2.A2
NetIC1_14: IC1.14(PA4/SPI1_NSS/USART2_CK/ADC12_IN4) ; port SPI_ENABLE
NetIC1_15: IC1.15(PA5/SPI1_SCK/ADC12_IN5) ; port SPI_SCK
NetIC1_16: IC1.16(PA6/SPI1_MISO/ADC12_IN6/TIM3_CH1/TIM1_BKIN) ; port SPI_MISO
NetIC1_17: IC1.17(PA7/SPI1_MOSI/ADC12_IN7/TIM3_CH2/TIM1_CH1N) ; port SPI_MOSI
NetP2_2: P2.2 R17.1

Not connected (* = marked no-connect by the designer): IC1 2(PC13/TAMPER-RTC) 10(PA0/WKUP/USART2_CTS/ADC12_IN0) 11(PA1/USART2_RTS/ADC12_IN1/TIM2_CH2) 12(PA2/USART2_TX/ADC12_IN2/TIM2_CH3) 13(PA3/USART2_RX/ADC12_IN3/TIM2_CH4) 18(PB0/ADC12_IN8/TIM3_CH3/TIM1_CH2N) 19(PB1/ADC12_IN9/TIM3_CH4/TIM1_CH3N) 20(PB2/BOOT1) 21(PB10/TIM2_CH3) 22(PB11/TIM2_CH4) 25(PB12/TIM1_BKIN) 26(PB13/TIM1_CH1N) 27(PB14/TIM1_CH2N) 28(PB15/TIM1_CH3N) 29(PA8/USART1_CK/TIM1_CH1/MCO) 30(PA9/USART1_TX/TIM1_CH2) 31(PA10/USART1_RX/TIM1_CH3) 38(PA15/JTDI/TIM2_CH1_ETR/SPI1_NSS) 39(PB3/JTDO/TIM2_CH2/TRACESWO/SPI1_SCK) 40(PB4/NJTRST/TIM3_CH1/SPI1_MISO) 41(PB5/I2C1_SMBA/TIM3_CH2/SPI1_MOSI) 42(PB6/I2C1_SCL/USART1_TX) 43(PB7/I2C1_SDA/USART1_RX)

### Library data of the parts
C22 C27 = CC0805MRX7R9BB104: as C15 on sheet Communication; Part Number: CC0805MRX7R9BB104; Value: 0.1 µF; Applications: General Purpose; Capacitance: 0.1 µF; componentlink1description: Datasheet; componentlink1url: https://www.yageo.com/upload/media/product/productsearch/datasheet/mlcc/UPY-GPHC_X7R_6.3V-to-50V_18.pdf; componentlink2description: DigiKey Link; componentlink2url: https://www.digikey.com/en/products/detail/yageo/CC0805MRX7R9BB104/5884281; Device Package: 0805 (2012 Metric); lastupdated: 9.02.2024 20:16:09; Lifecycle Status: Active; Minimum Order: 1; Mounting Type: Surface Mount, MLCC; Operating Temperature: -55°C ~ 125°C; Package / Case: 0805 (2012 Metric); packaging: TapeAndReel; partid: 2475; Part Status: Active; price: 0.01; series: CC; Size / Dimension: 0.079" L x 0.049" W (2.00mm x 1.25mm); Supplier 1: DigiKey; Supplier Part Number 1: 311-4351-1-ND; Temperature Coefficient: X7R; Thickness (Max): 0.037" (0.95mm); Voltage - Rated: 50V
C23 C24 = CC0805CRNPO9BN1R0: CAP CER 1PF 50V C0G/NPO 0805; manufacturer: Yageo; Temperature Coefficient: C0G, NP0; Tolerance: ±0.25pF; Part Number: CC0805CRNPO9BN1R0; Value: 1 pF; Applications: General Purpose; Capacitance: 1 pF; componentlink1description: Datasheet; componentlink1url: https://www.yageo.com/upload/media/product/productsearch/datasheet/mlcc/UPY-GP_NP0_16V-to-50V_17.pdf; componentlink2description: DigiKey Link; componentlink2url: https://www.digikey.com/en/products/detail/yageo/CC0805CRNPO9BN1R0/302823; Device Package: 0805 (2012 Metric); lastupdated: 9.02.2024 20:15:42; Lifecycle Status: Active; Minimum Order: 1; Mounting Type: Surface Mount, MLCC; Operating Temperature: -55°C ~ 125°C; Package / Case: 0805 (2012 Metric); packaging: TapeAndReel; partid: 12750; Part Status: Active; price: 0.01; series: CC; Size / Dimension: 0.079" L x 0.049" W (2.00mm x 1.25mm); Supplier 1: DigiKey; Supplier Part Number 1: 311-1089-1-ND; Thickness (Max): 0.024" (0.60mm); Voltage - Rated: 50V
C25 C26 = VJ0805A180JXXCW1BC: CAP CER 18PF 25V C0G/NP0 0805; manufacturer: Vishay Vitramon; Temperature Coefficient: C0G, NP0; Tolerance: ±5%; Part Number: VJ0805A180JXXCW1BC; Value: 18 pF; Applications: General Purpose; Capacitance: 18 pF; componentlink1description: Datasheet; componentlink1url: https://www.vishay.com/docs/28548/vjw1bcbascomseries.pdf; componentlink2description: DigiKey Link; componentlink2url: https://www.digikey.com/en/products/detail/vishay-vitramon/VJ0805A180JXXCW1BC/8307782; Device Package: 0805 (2012 Metric); lastupdated: 9.02.2024 20:15:03; Lifecycle Status: Active; Minimum Order: 1; Mounting Type: Surface Mount, MLCC; Operating Temperature: -55°C ~ 125°C; Package / Case: 0805 (2012 Metric); packaging: TapeAndReel; partid: 31672; Part Status: Active; price: 0.01; series: VJ W1BC; Size / Dimension: 0.079" L x 0.049" W (2.00mm x 1.25mm); Supplier 1: DigiKey; Supplier Part Number 1: 720-VJ0805A180JXXCW1BCCT-ND; Thickness (Max): 0.028" (0.70mm); Voltage - Rated: 25V
IC1 = STM32F103C6T7A: IC MCU 32BIT 32KB FLASH 48LQFP; Manufacturer: STMicroelectronics; Connectivity: CANbus, I²C, IrDA, LINbus, SPI, UART/USART, USB; Core Processor: ARM® Cortex®-M3; Core Size: 32-Bit; Data Converters: A/D 10x12b; Number of I/O: 37; Oscillator Type: Internal; Peripherals: DMA, Motor Control PWM, PDR, POR, PVD, PWM, Temp Sensor, WDT; Program Memory Size: 32KB (32K x 8); RAM Size: 10K x 8; Speed: 72MHz; Voltage - Supply (Vcc/Vdd): 2V ~ 3.6V; Part Number: STM32F103C6T7A; ComponentLink1Description: Datasheet; ComponentLink1URL: http://www.st.com/content/ccc/resource/technical/document/datasheet/0d/93/e0/d7/77/bf/4c/54/CD00210843.pdf/files/CD00210843.pdf/jcr:content/translations/en.CD00210843.pdf; ComponentLink2Description: DigiKey Link; ComponentLink2URL: //digikey.com/product-detail/en/stmicroelectronics/STM32F103C6T7A/497-11516-ND/2035348; Device Package: 48-LQFP; LastUpdated: 4.12.2019 05:20:26; Lifecycle Status: 0; Minimum Order: 1; Mounting Type: Surface Mount; Operating Temperature: -40°C ~ 105°C (TA); Package / Case: 48-LQFP; Packaging: Tray; PartId: 102; Part Status: Active; Price: 4.52; Program Memory Type: FLASH; Series: STM32F1; Supplier 1: DigiKey; Supplier Part Number 1: 497-11516-ND; Supplier Device Package: 48-LQFP (7x7)
J4 = BC501SM-TR: Holder Coin Cell For Cr1220 Smd; MF: MPD _Memory; Digi-Key_Purchase_URL: https://www.digikey.com/product-detail/en/mpd-memory-protection-devices/BC501SM-TR/BC501SM-TRCT-ND/5418194?utm_source=snapeda&utm_medium=aggregator&utm_campaign=symbol; SnapEDA_Link: https://www.snapeda.com/parts/BC501SM-TR/MPD%20%28Memory%20Protection%20Devices%29/view-part/479427/?ref=snap; MP: BC501SM-TR; Digi-Key_Part_Number: BC501SM-TRCT-ND; Package: DFN-8 MPD; Value: *
P1 = 61900411121: WR-WTB THT Male Vertical Locking Header, pitch 2.54mm, 4pins; Manufacturer: Wurth Elektronik; Contact Resistance: 20mOhm; Rated Current: 3A; Working Voltage: 250VAC; Withstanding Voltage: 1000VAC; Manufacturer Part Number: 61900411121; Category: Wire-to-Board Connectors; Match Code: WR-WTB; ComponentLink1Description: Website Link; ComponentLink1URL: https://www.we-online.com/redexpert/article/61900411121?ad; ComponentLink2Description: Datasheet Link; ComponentLink2URL: https://www.we-online.com/redexpert/spec/61900411121?ad; Mount: Through Hole; Operating Temperature Max: 105°C; Operating Temperature Min: -40°C; Packaging: Bag; Length: 10.16mm; Width: 5.8mm; Height: 11.5mm; Gender: Male; Number of Pins: 4; Number of Rows: 1; Orientation: Vertical; Pitch: 2.54mm
P2 = 61900311121: WR-WTB THT Male Vertical Locking Header, pitch 2.54mm, 3pins; Manufacturer: Wurth Elektronik; Contact Resistance: 20mOhm; Rated Current: 3A; Working Voltage: 250VAC; Withstanding Voltage: 1000VAC; Manufacturer Part Number: 61900311121; Category: Wire-to-Board Connectors; Match Code: WR-WTB; ComponentLink1Description: Website Link; ComponentLink1URL: https://www.we-online.com/redexpert/article/61900311121?ad; ComponentLink2Description: Datasheet Link; ComponentLink2URL: https://www.we-online.com/redexpert/spec/61900311121?ad; Mount: Through Hole; Operating Temperature Max: 105°C; Operating Temperature Min: -40°C; Packaging: Bag; Length: 7.62mm; Width: 5.8mm; Height: 11.5mm; Gender: Male; Number of Pins: 3; Number of Rows: 1; Orientation: Vertical; Pitch: 2.54mm
R16 = 5107: as R11 on sheet Communication; Value: 0 Ohms; ComponentLink1Description: Datasheet; ComponentLink1URL: http://www.keyelco.com/product-pdf.cfm?p=14350; ComponentLink2Description: DigiKey Link; ComponentLink2URL: https://www.digikey.com/en/products/detail/keystone-electronics/5107/7942981; Composition: Metal Element; Device Package: 0805 (2012 Metric); Height - Seated (Max): 0.033" (0.84mm); LastUpdated: 8.02.2024 21:01:23; Lifecycle Status: Active; Minimum Order: 1; Number of Terminations: 2; Package / Case: 0805 (2012 Metric); Packaging: TapeAndReel; PartId: 45276; Part Status: Active; Price: 0.16; Resistance: 0 Ohms; Series: -; Size / Dimension: 0.079" L x 0.049" W (2.00mm x 1.25mm); Supplier 1: DigiKey; Supplier Part Number 1: 36-5107CT-ND; Supplier Device Package: 0805; Tolerance: Jumper
R17 R18 = 2176093-5: as R7 on sheet Communication; Part Number: 2176093-5; Value: 10 kOhms; ComponentLink1Description: Datasheet; ComponentLink1URL: https://www.te.com/commerce/DocumentDelivery/DDEController?Action=srchrtrv&DocNm=1773272&DocType=DS&DocLang=English; ComponentLink2Description: DigiKey Link; ComponentLink2URL: https://www.digikey.com/en/products/detail/te-connectivity-passive-product/2176093-5/4034107; Composition: Thin Film; Device Package: 0805 (2012 Metric); Height - Seated (Max): 0.026" (0.65mm); LastUpdated: 8.02.2024 21:02:35; Lifecycle Status: Active; Minimum Order: 1; Number of Terminations: 2; Operating Temperature: -55°C ~ 155°C; Package / Case: 0805 (2012 Metric); Packaging: TapeAndReel; PartId: 28478; Part Status: Active; Price: 0.14; Resistance: 10 kOhms; Series: RP73P, Holsworthy; Size / Dimension: 0.079" L x 0.049" W (2.00mm x 1.25mm); Supplier 1: DigiKey; Supplier Part Number 1: A110639CT-ND; Supplier Device Package: 0805; Tolerance: ±0.1%
SW2 = 430152043826: WS-TASV SMT Tact Switch, L6 x W6 x H4.3mm, 260g, SPST-NO, 12V, 50mA; Manufacturer: Wurth Elektronik; Washable: No; Manufacturer Part Number: 430152043826; Category: Tact Switches; Match Code: WS-TASV; ComponentLink1Description: Website Link; ComponentLink1URL: https://www.we-online.com/redexpert/article/430152043826?ad; ComponentLink2Description: Datasheet Link; ComponentLink2URL: https://www.we-online.com/redexpert/spec/430152043826?ad; Mount: Surface Mount; Operating Temperature Max: 85°C; Operating Temperature Min: -40°C; Packaging: Tape and Reel; Length: 6mm; Width: 6mm; Height: 4.3mm; Circuit: SPST-NO; Contact Material: Stainless Steel; Contact Plating: Silver; Operation Force: 260g; Rated Current: 50mA; Rated Voltage (DC): 12V; Terminal Material: Copper Alloy; Terminal Plating: Silver
X1 = ECS-100-20-4VX: ECS-100-20-4VX 10MHz; Manufacturer: ESC INC; Frequency Stability: ±50ppm; Lifcycle Status: Active; Load Capacitance: 20 pF; Operating Mode: Fumdamental; ESR (Equivalent Series Resistance): 80 Ohms; Drive Level: 500 uW; Aging (First Year) @ 25°C: ±5 ppm; Frequency Tolerance: ±50ppm; Mounting Type: Through Hole; Supplier 1: Arrow Electronics; Operating Temperature: -10°C ~ 70°C; Packaging: HC-49UCCX; Datasheet: https://ecsxtal.com/store/pdf/HC-49USS.pdf; Supplier Part Number 1: ECS-100-20-4VX
Y1 = ABS07-32.768KHZ-6-T: CRYSTAL 32.7680KHZ 6PF SMD; Manufacturer: Abracon LLC; ESR (Equivalent Series Resistance): 70 kOhms; Frequency Tolerance: ±20ppm; Operating Mode: Fundamental; Part Number: ABS07-32.768KHZ-6-T; ComponentLink1Description: Datasheet; ComponentLink1URL: https://abracon.com/Resonators/ABS07.pdf; ComponentLink2Description: DigiKey Link; ComponentLink2URL: https://www.digikey.com/en/products/detail/abracon-llc/ABS07-32-768KHZ-6-T/3508065; Frequency: 32.768 kHz; Height - Seated (Max): 0.035" (0.90mm); LastUpdated: 3.06.2024 20:02:04; Lifecycle Status: Active; Load Capacitance: 6pF; Minimum Order: 1; Mounting Type: Surface Mount; Operating Temperature: -40°C ~ 85°C; Package / Case: 2-SMD, No Lead; Packaging: TapeAndReel; PartId: 379; Part Status: Active; Price: 0.37; Series: ABS07; Size / Dimension: 0.126" L x 0.059" W (3.20mm x 1.50mm); Supplier 1: DigiKey; Supplier Part Number 1: 535-11898-1-ND; Type: kHz Crystal (Tuning Fork); Value: 32.768 kHz

## Sheet Filters.SchDoc
size A4; SheetNumber: 4; SheetTotal: 4
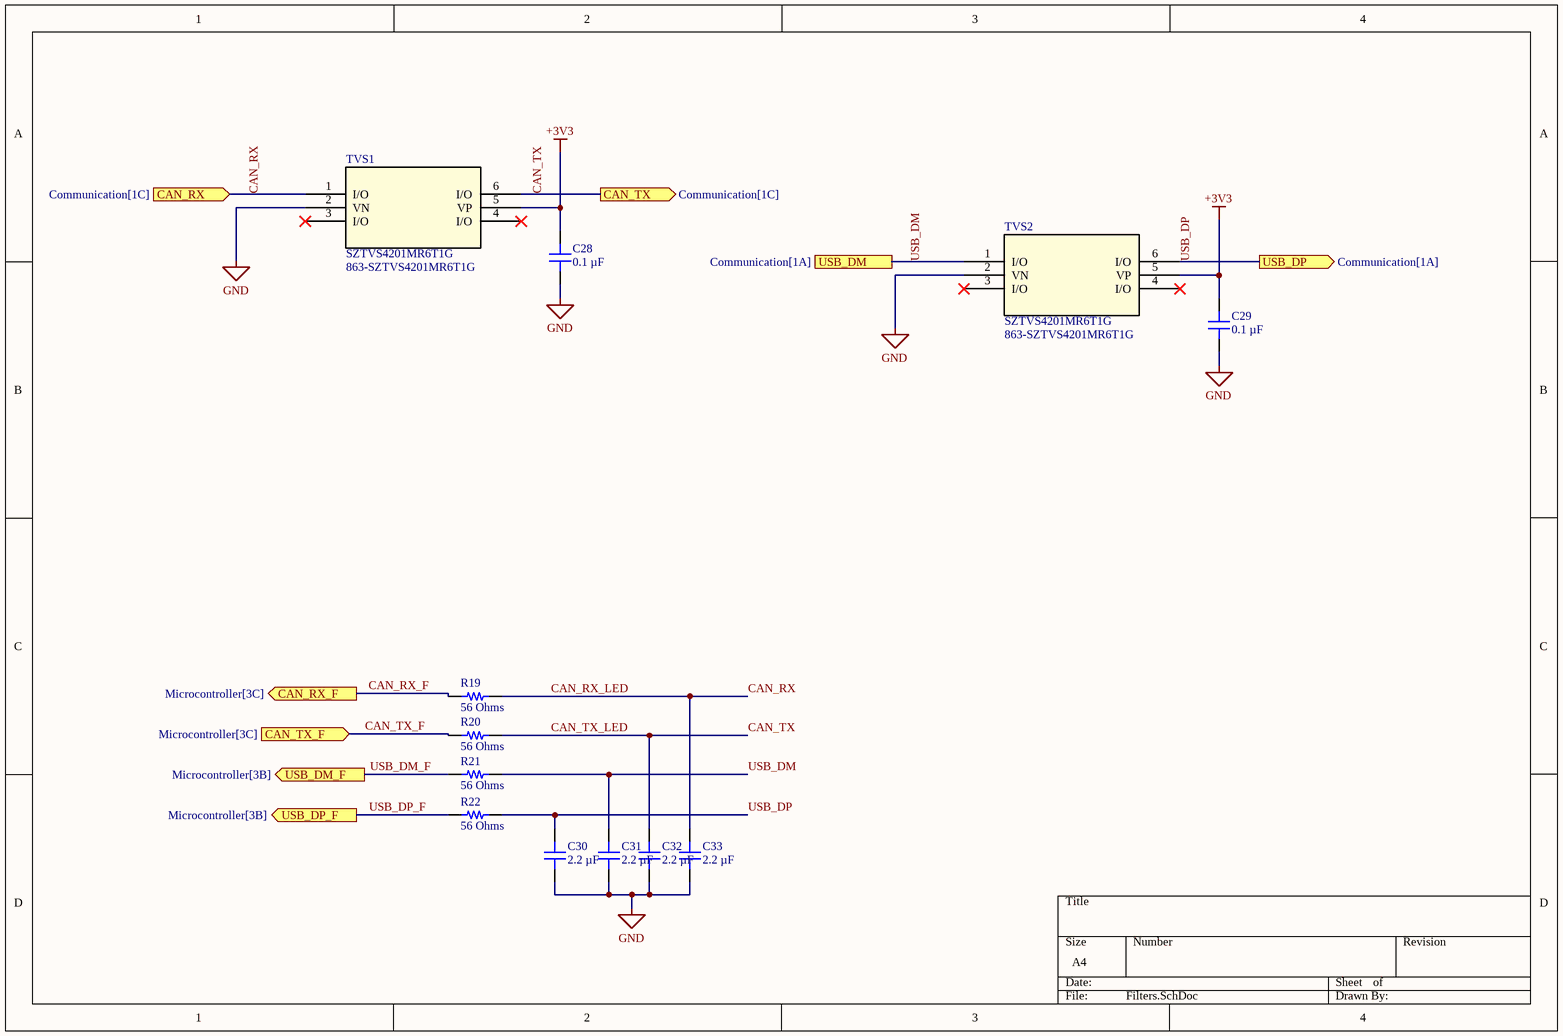
[diagram p3: Filters.SchDoc]

### Parts
C28  0.1 µF  [CAP 0805_2012]
C29  0.1 µF  [CAP 0805_2012]
C30  2.2 µF  [CAP 0805_2012]
C31  2.2 µF  [CAP 0805_2012]
C32  2.2 µF  [CAP 0805_2012]
C33  2.2 µF  [CAP 0805_2012]
R19  56 Ohms  [RES 0805_2012]
R20  56 Ohms  [RES 0805_2012]
R21  56 Ohms  [RES 0805_2012]
R22  56 Ohms  [RES 0805_2012]
TVS1  SZTVS4201MR6T1G  Supplier Part Number 1: 863-SZTVS4201MR6T1G  [SOP95P275X110-6N]
TVS2  SZTVS4201MR6T1G  Supplier Part Number 1: 863-SZTVS4201MR6T1G  [SOP95P275X110-6N]

### Ports
CAN_RX (in, see Communication[1C]), CAN_RX_F (out, see Microcontroller[3C]), CAN_TX (out, see Communication[1C]), CAN_TX_F (in, see Microcontroller[3C]), USB_DM (out, see Communication[1A]), USB_DM_F (out, see Microcontroller[3B]), USB_DP (out, see Communication[1A]), USB_DP_F (out, see Microcontroller[3B])

### Nets
+3V3: C28.2 C29.2 TVS1.5(VP) TVS2.5(VP)
GND: C28.1 C29.1 C30.1 C31.1 C32.1 C33.1 TVS1.2(VN) TVS2.2(VN)
CAN_RX: C33.2 R19.2 TVS1.1(I/O) ; port CAN_RX  [also labelled CAN_RX_LED]
CAN_RX_F: R19.1 ; port CAN_RX_F
CAN_TX: C32.2 R20.2 TVS1.6(I/O) ; port CAN_TX  [also labelled CAN_TX_LED]
CAN_TX_F: R20.1 ; port CAN_TX_F
USB_DM: C31.2 R21.2 TVS2.1(I/O) ; port USB_DM
USB_DM_F: R21.1 ; port USB_DM_F
USB_DP: C30.2 R22.2 TVS2.6(I/O) ; port USB_DP
USB_DP_F: R22.1 ; port USB_DP_F

Not connected (* = marked no-connect by the designer): TVS1 3(I/O)* 4(I/O)*; TVS2 3(I/O)* 4(I/O)*

### Library data of the parts
C28 C29 = CC0805MRX7R9BB104: as C15 on sheet Communication; Part Number: CC0805MRX7R9BB104; Value: 0.1 µF; Applications: General Purpose; Capacitance: 0.1 µF; componentlink1description: Datasheet; componentlink1url: https://www.yageo.com/upload/media/product/productsearch/datasheet/mlcc/UPY-GPHC_X7R_6.3V-to-50V_18.pdf; componentlink2description: DigiKey Link; componentlink2url: https://www.digikey.com/en/products/detail/yageo/CC0805MRX7R9BB104/5884281; Device Package: 0805 (2012 Metric); lastupdated: 9.02.2024 20:16:09; Lifecycle Status: Active; Minimum Order: 1; Mounting Type: Surface Mount, MLCC; Operating Temperature: -55°C ~ 125°C; Package / Case: 0805 (2012 Metric); packaging: TapeAndReel; partid: 2475; Part Status: Active; price: 0.01; series: CC; Size / Dimension: 0.079" L x 0.049" W (2.00mm x 1.25mm); Supplier 1: DigiKey; Supplier Part Number 1: 311-4351-1-ND; Temperature Coefficient: X7R; Thickness (Max): 0.037" (0.95mm); Voltage - Rated: 50V
C30-C33 = TMK212B7225MG-TR: CAP CER 2.2UF 25V X7R 0805; manufacturer: Taiyo Yuden; Tolerance: ±20%; Part Number: TMK212B7225MG-TR; Value: 2.2 µF; Applications: SMPS Filtering; Capacitance: 2.2 µF; componentlink1description: Datasheet; componentlink1url: https://www.yuden.co.jp/productdata/catalog/mlcc01_e.pdf; componentlink2description: DigiKey Link; componentlink2url: https://www.digikey.com/en/products/detail/taiyo-yuden/TMK212B7225MG-TR/6563525; Device Package: 0805 (2012 Metric); lastupdated: 9.02.2024 20:16:05; Lifecycle Status: Active; Minimum Order: 1; Mounting Type: Surface Mount, MLCC; Operating Temperature: -55°C ~ 125°C; Package / Case: 0805 (2012 Metric); packaging: TapeAndReel; partid: 3807; Part Status: Active; price: 0.04; series: M; Size / Dimension: 0.079" L x 0.049" W (2.00mm x 1.25mm); Supplier 1: DigiKey; Supplier Part Number 1: 587-4932-1-ND; Temperature Coefficient: X7R; Thickness (Max): 0.053" (1.35mm); Voltage - Rated: 25V
R19-R22 = CPF0805B56RE1: RES SMD 56 OHM 0.1% 1/10W 0805; Manufacturer: TE Connectivity Passive Product; Power (Watts): 0.1W, 1/10W; Temperature Coefficient: ±25ppm/°C; Part Number: CPF0805B56RE1; Value: 56 Ohms; ComponentLink1Description: Datasheet; ComponentLink1URL: https://www.te.com/commerce/DocumentDelivery/DDEController?Action=srchrtrv&DocNm=1773200&DocType=DS&DocLang=English; ComponentLink2Description: DigiKey Link; ComponentLink2URL: https://www.digikey.com/en/products/detail/te-connectivity-passive-product/CPF0805B56RE1/2382003; Composition: Thin Film; Device Package: 0805 (2012 Metric); Height - Seated (Max): 0.026" (0.65mm); LastUpdated: 8.02.2024 21:02:01; Lifecycle Status: Active; Minimum Order: 1; Number of Terminations: 2; Operating Temperature: -55°C ~ 155°C; Package / Case: 0805 (2012 Metric); Packaging: TapeAndReel; PartId: 36553; Part Status: Active; Price: 0.12; Resistance: 56 Ohms; Series: CPF, Neohm; Size / Dimension: 0.079" L x 0.049" W (2.00mm x 1.25mm); Supplier 1: DigiKey; Supplier Part Number 1: A103223CT-ND; Supplier Device Package: 0805; Tolerance: ±0.1%
TVS1 TVS2 = SZTVS4201MR6T1G_1: Mfr_Name: onsemi; Copyright: Copyright (C) 2021 Ultra Librarian. All rights reserved.; Manufacturer_Part_Number: SZTVS4201MR6T1G; RefDes: RefDes; Type: DEV; Supplier 1: Mouser

## Nets that join several sheets
+3V3: Power (9 pins), Communication (8 pins), Microcontroller (9 pins), Filters (C28.2 C29.2 TVS1.5 TVS2.5)
+5V: Power (7 pins), Communication (C18.2 C19.1 L1.1 U3.3)
GND: Power (15 pins), Communication (19 pins), Microcontroller (15 pins), Filters (8 pins)
CAN_RX: Communication (U3.4), Filters (C33.2 R19.2 TVS1.1)
CAN_RX_F: Microcontroller (IC1.45), Filters (R19.1)
CAN_TX: Communication (U3.1), Filters (C32.2 R20.2 TVS1.6)
CAN_TX_F: Microcontroller (IC1.46), Filters (R20.1)
NetIC1_14: Communication (J2.2 R10.1), Microcontroller (IC1.14)
NetIC1_15: Communication (J2.5 R8.1), Microcontroller (IC1.15)
NetIC1_16: Communication (J2.7 R7.1), Microcontroller (IC1.16)
NetIC1_17: Communication (J2.3 R9.1), Microcontroller (IC1.17)
USB_DM: Communication (J1.2), Filters (C31.2 R21.2 TVS2.1)
USB_DM_F: Microcontroller (IC1.32), Filters (R21.1)
USB_DP: Communication (J1.3), Filters (C30.2 R22.2 TVS2.6)
USB_DP_F: Microcontroller (IC1.33), Filters (R22.1)